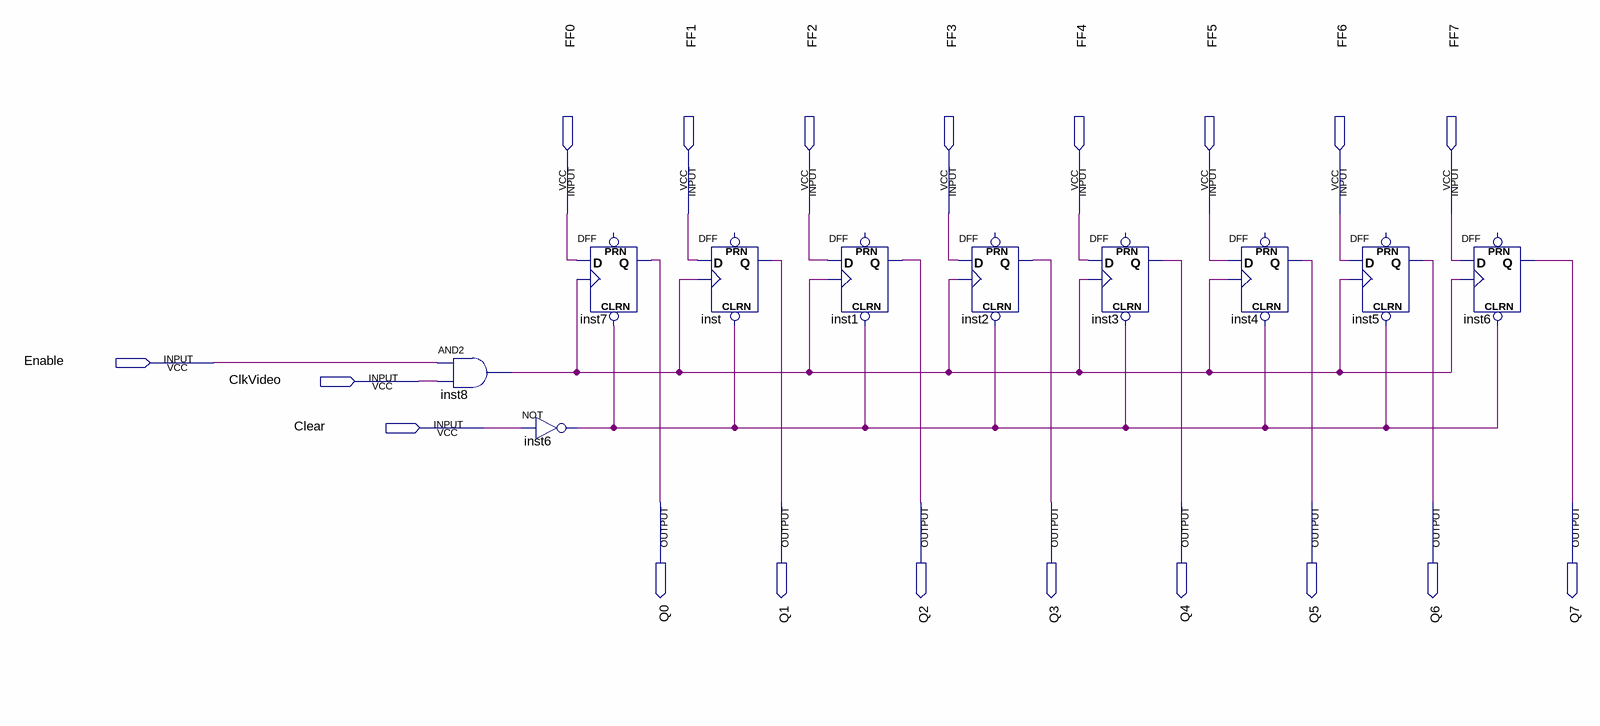
[diagram p0: schematic sheet]
// Quartus schematic Registrador 8-Bits.bdf as structural Verilog: 10 symbols, 19 pins
module \Registrador_8-Bits  (
  input  FF0,
  input  FF1,
  input  FF2,
  input  FF3,
  input  FF4,
  input  FF5,
  input  FF6,
  input  FF7,
  input  Enable,
  input  ClkVideo,
  input  Clear,
  output Q0,
  output Q1,
  output Q2,
  output Q3,
  output Q4,
  output Q5,
  output Q6,
  output Q7
);

  wire inst6_out, inst8_out;

  and inst8 (inst8_out, Enable, ClkVideo);
  not inst6 (inst6_out, Clear);
  DFF inst7 (.CLRN(inst6_out), .CLK(inst8_out), .D(FF0), .Q(Q0));  // open: PRN
  DFF inst (.CLRN(inst6_out), .CLK(inst8_out), .D(FF1), .Q(Q1));  // open: PRN
  DFF inst1 (.CLRN(inst6_out), .CLK(inst8_out), .D(FF2), .Q(Q2));  // open: PRN
  DFF inst2 (.CLRN(inst6_out), .CLK(inst8_out), .D(FF3), .Q(Q3));  // open: PRN
  DFF inst3 (.CLRN(inst6_out), .CLK(inst8_out), .D(FF4), .Q(Q4));  // open: PRN
  DFF inst4 (.CLRN(inst6_out), .CLK(inst8_out), .D(FF5), .Q(Q5));  // open: PRN
  DFF inst5 (.CLRN(inst6_out), .CLK(inst8_out), .D(FF6), .Q(Q6));  // open: PRN
  DFF inst6_dup2 (.CLRN(inst6_out), .CLK(inst8_out), .D(FF7), .Q(Q7));  // open: PRN
endmodule
